# EAGLE design ATESLEME (EAGLE 9.6.2)
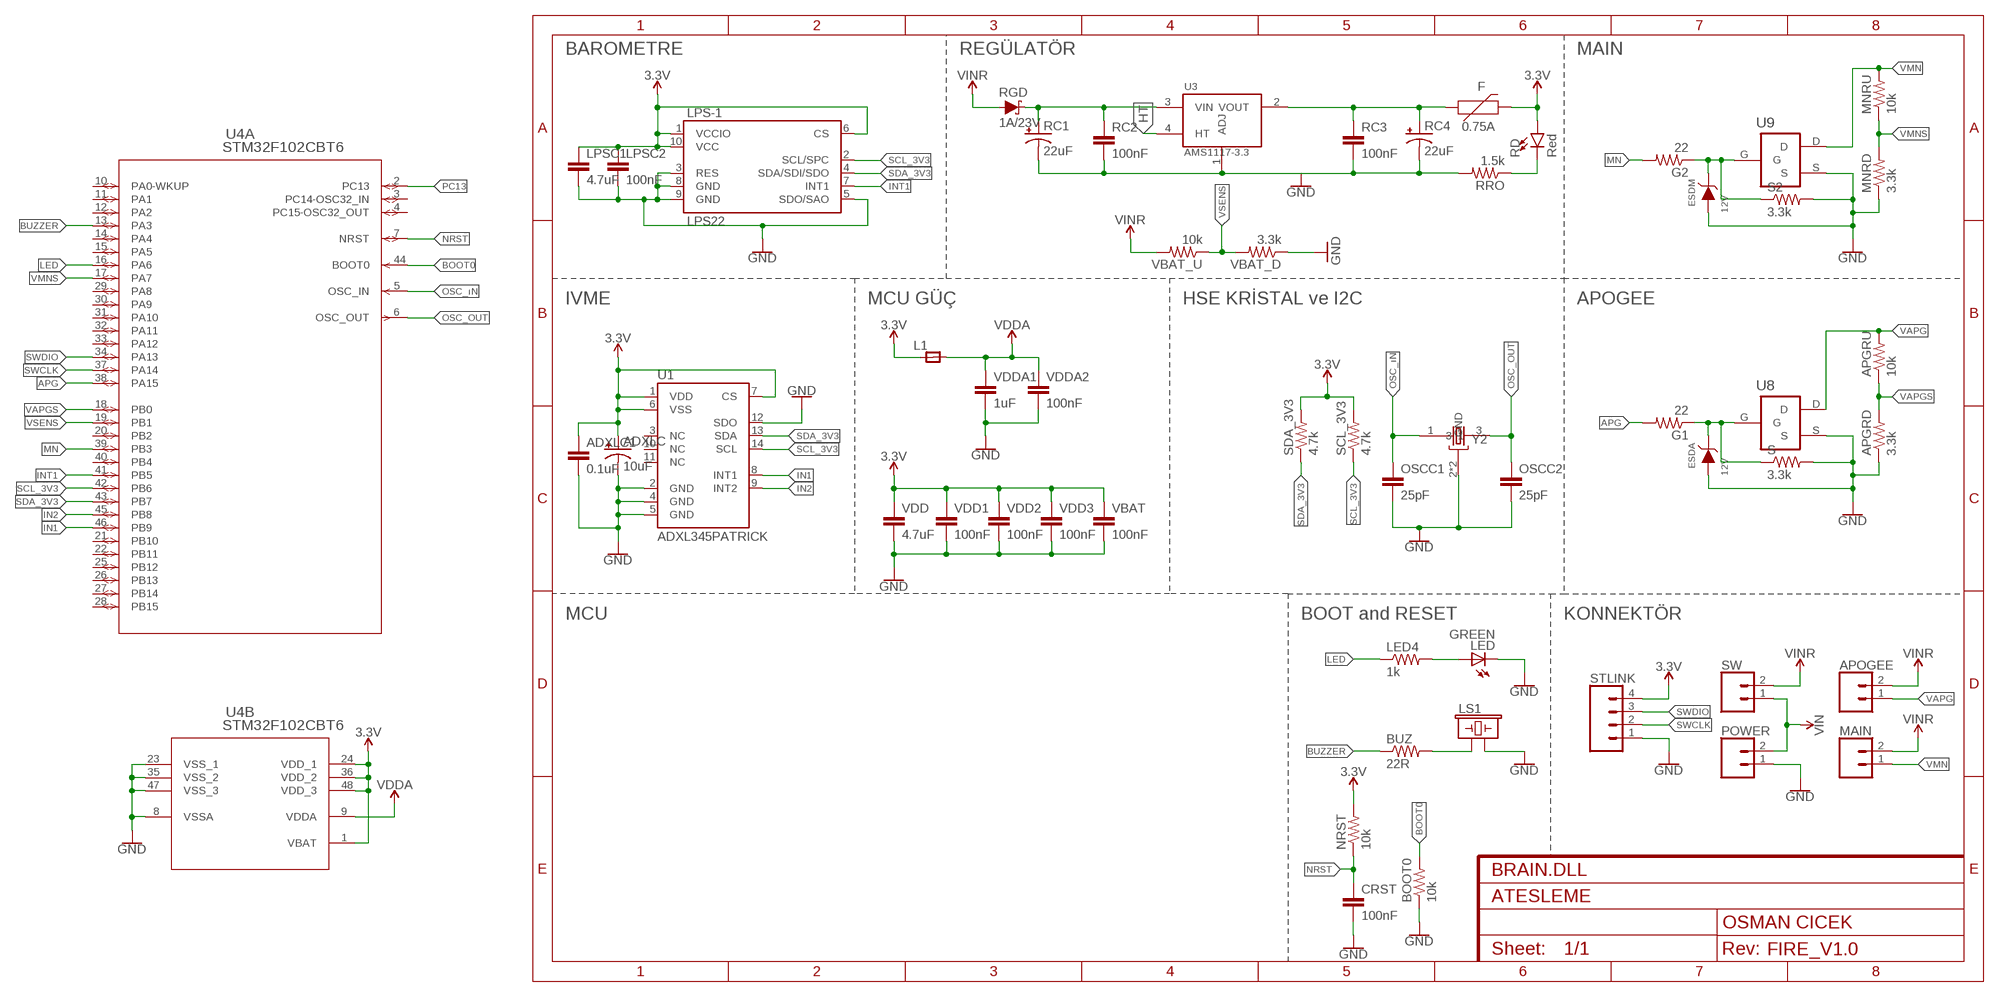
[diagram p0: schematic, sheet 1]
FRAME1 (FRAME-A4L): ATESLEME: PART1; CNAME: BRAIN.DLL; CREVISION: FIRE_V1.0; DESIGNER: OSMAN CICEK

## Parts
ADXLC  10uF  10UF-POLAR-EIA3216-16V-10%(TANT)  [EIA3216]
ADXLC1  0.1uF  0.1UF-0603-25V-(+80/-20%)  [0603]
APGRD  3.3k  2.0KOHM1/10W5%(0603)  [0603-RES]
APGRU  10k  2.0KOHM1/10W5%(0603)  [0603-RES]
APOGEE  CONN_023.5MM-NO_SILK  [SCREWTERMINAL-3.5MM-2-NS]
BOOT0  10k  2.0KOHM1/10W5%(0603)  [0603-RES]
BUZ  22R  2.0KOHM1/10W5%(0603)  [0603-RES]
CRST  100nF  0.1UF-0603-25V-(+80/-20%)  [0603]
ESDA  12V  WE-TVSP_DO-214AC_400W_UNI_824500102  [WE-TVSP_DO-214AC_UNIDIRECTIONAL]
ESDM  12V  WE-TVSP_DO-214AC_400W_UNI_824500102  [WE-TVSP_DO-214AC_UNIDIRECTIONAL]
F  0.75A  PPTC_THREE-QUARTER-AMP  [1206]
G1  22  2.0KOHM1/10W5%(0603)  [0603-RES]
G2  22  2.0KOHM1/10W5%(0603)  [0603-RES]
L1  RC-MASTER-SMD_FB_0805MP  [RC-MASTER-SMD_L0805MP]
LED  GREEN  LED-RED0603  [LED-0603]
LED4  1k  2.0KOHM1/10W5%(0603)  [0603-RES]
LPS-1  LPS22  LPS2XH-22  [LPS22H]
LPSC1  4.7uF  0.1UF-0603-25V-(+80/-20%)  [0603]
LPSC2  100nF  0.1UF-0603-25V-(+80/-20%)  [0603]
LS1  BUZZER-PTH  [BUZZER-12MM]
MAIN  CONN_023.5MM-NO_SILK  [SCREWTERMINAL-3.5MM-2-NS]
MNRD  3.3k  2.0KOHM1/10W5%(0603)  [0603-RES]
MNRU  10k  2.0KOHM1/10W5%(0603)  [0603-RES]
NRST  10k  2.0KOHM1/10W5%(0603)  [0603-RES]
OSCC1  25pF  0.1UF-0603-25V-(+80/-20%)  [0603]
OSCC2  25pF  0.1UF-0603-25V-(+80/-20%)  [0603]
POWER  CONN_023.5MM-NO_SILK  [SCREWTERMINAL-3.5MM-2-NS]
RC1  22uF  10UF-POLAR-EIA3528-20V-10%(TANT)  [EIA3528]
RC2  100nF  0.1UF-0603-25V-(+80/-20%)  [0603]
RC3  100nF  0.1UF-0603-25V-(+80/-20%)  [0603]
RC4  22uF  10UF-POLAR-EIA3528-20V-10%(TANT)  [EIA3528]
RD  Red  LED-RED0603-SMART  [LED-0603]
RGD  1A/23V  DIODE-SCHOTTKY-BAT20J  [SOD-323]
RRO  1.5k  2.0KOHM1/10W5%(0603)  [0603-RES]
S  3.3k  2.0KOHM1/10W5%(0603)  [0603-RES]
S2  3.3k  2.0KOHM1/10W5%(0603)  [0603-RES]
SCL_3V3  4.7k  2.0KOHM1/10W5%(0603)  [0603-RES]
SDA_3V3  4.7k  2.0KOHM1/10W5%(0603)  [0603-RES]
STLINK  CONN_04  [1X04]
SW  CONN_023.5MM-NO_SILK  [SCREWTERMINAL-3.5MM-2-NS]
U1  ADXL345PATRICK  [LGA14_1:1_PATRICK]
U3  AMS1117-3.3  [SOT229P700X180-4N]
U4  STM32F102CBT6  [LQFP48-7X7MM]
U8  IRLML6344TRPBF  [SOT95P240X112-3N]
U9  IRLML6344TRPBF  [SOT95P240X112-3N]
VBAT  100nF  0.1UF-0603-25V-(+80/-20%)  [0603]
VBAT_D  3.3k  2.0KOHM1/10W5%(0603)  [0603-RES]
VBAT_U  10k  2.0KOHM1/10W5%(0603)  [0603-RES]
VDD  4.7uF  0.1UF-0603-25V-(+80/-20%)  [0603]
VDD1  100nF  0.1UF-0603-25V-(+80/-20%)  [0603]
VDD2  100nF  0.1UF-0603-25V-(+80/-20%)  [0603]
VDD3  100nF  0.1UF-0603-25V-(+80/-20%)  [0603]
VDDA1  1uF  0.1UF-0603-25V-(+80/-20%)  [0603]
VDDA2  100nF  0.1UF-0603-25V-(+80/-20%)  [0603]
Y2  ABM2B-8.000MHZ-10-1-U-T  ABM3B-26.000MHZ-10-1-U-T  [OSCCC500X320X110-4N]

## Nets
3.3V: ADXLC1.1 ADXLC.+ F.2 L1.1 LPS-1.1(VCCIO) LPS-1.6(CS) LPS-1.10(VCC) LPSC1.1 LPSC2.1 NRST.2 RD.A SCL_3V3.2 SDA_3V3.2 STLINK.4 U1.1(VDD) U1.6(VSS) U1.7(CS) U4.1(B:VBAT) U4.24(B:VDD_1) U4.36(B:VDD_2) U4.48(B:VDD_3) VBAT.1 VDD1.1 VDD2.1 VDD3.1 VDD.1
APG: G1.2 U4.38(A:PA15)
BOOT0: BOOT0.2 U4.44(A:BOOT0)
BUZZER: BUZ.1 U4.13(A:PA3)
GND: ADXLC1.2 ADXLC.- APGRD.1 BOOT0.1 CRST.2 ESDA.2(A) ESDM.2(A) LED.C LPS-1.3(RES) LPS-1.5(SDO/SAO) LPS-1.8(GND) LPS-1.9(GND) LPSC1.2 LPSC2.2 LS1.- MNRD.1 OSCC1.2 OSCC2.2 POWER.1 RC1.C(-) RC2.2 RC3.2 RC4.C(-) RRO.2 S2.2 S.2 STLINK.1 U1.2(GND) U1.4(GND) U1.5(GND) U1.12(SDO) U3.1(ADJ) U4.8(B:VSSA) U4.23(B:VSS_1) U4.35(B:VSS_2) U4.47(B:VSS_3) U8.S U9.S VBAT.2 VBAT_D.1 VDD1.2 VDD2.2 VDD3.2 VDD.2 VDDA1.2 VDDA2.2 Y2.2(GND) Y2.4(GND)
HT: U3.4(HT)
IN1: U1.8(INT1) U4.46(A:PB9)
IN2: U1.9(INT2) U4.45(A:PB8)
INT1: LPS-1.7(INT1) U4.41(A:PB5)
LED: LED4.1 U4.16(A:PA6)
MN: G2.2 U4.39(A:PB3)
N$1: F.1 RC3.1 RC4.A(+) U3.2(VOUT)
N$2: RD.C RRO.1
N$8: ESDM.1(C) G2.1 S2.1 U9.G
N$10: LED4.2 LED.A
N$13: BUZ.2 LS1.+
N$14: ESDA.1(C) G1.1 S.1 U8.G
NRST: CRST.1 NRST.1 U4.7(A:NRST)
OSC_OUT: OSCC2.1 U4.6(A:OSC_OUT) Y2.3
OSC_ıN: OSCC1.1 U4.5(A:OSC_IN) Y2.1
PC13: U4.2(A:PC13)
SCL_3V3: LPS-1.2(SCL/SPC) SCL_3V3.1 U1.14(SCL) U4.42(A:PB6)
SDA_3V3: LPS-1.4(SDA/SDI/SDO) SDA_3V3.1 U1.13(SDA) U4.43(A:PB7)
SWCLK: STLINK.2 U4.37(A:PA14)
SWDIO: STLINK.3 U4.34(A:PA13)
VAPG: APGRU.2 APOGEE.1 U8.D
VAPGS: APGRD.2 APGRU.1 U4.18(A:PB0)
VCC: POWER.2 SW.1 ; supply symbol labelled VIN
VDDA: L1.2 U4.9(B:VDDA) VDDA1.1 VDDA2.1
VIN: APOGEE.2 MAIN.2 RGD.A SW.2 VBAT_U.2 ; supply symbol labelled VINR
VMN: MAIN.1 MNRU.2 U9.D
VMNS: MNRD.2 MNRU.1 U4.17(A:PA7)
VNR: RC1.A(+) RC2.1 RGD.C U3.3(VIN)
VSENS: U4.19(A:PB1) VBAT_D.2 VBAT_U.1
Unconnected: U1.3(NC) U1.10(NC) U1.11(NC) U4.3(A:PC14-OSC32_IN) U4.4(A:PC15-OSC32_OUT) U4.10(A:PA0-WKUP) U4.11(A:PA1) U4.12(A:PA2) U4.14(A:PA4) U4.15(A:PA5) U4.20(A:PB2) U4.21(A:PB10) U4.22(A:PB11) U4.25(A:PB12) U4.26(A:PB13) U4.27(A:PB14) U4.28(A:PB15) U4.29(A:PA8) U4.30(A:PA9) U4.31(A:PA10) U4.32(A:PA11) U4.33(A:PA12) U4.40(A:PB4)

## Notes on the sheet
- BAROMETRE | REGÜLATÖR | MAIN
- IVME | MCU GÜÇ | HSE KRİSTAL ve I2C | APOGEE
- MCU | BOOT and RESET | KONNEKTÖR

## Library data of the parts
ADXLC = SparkFun-Capacitors:10UF-POLAR: 10.0µF polarized capacitors A capacitor is a passive two-terminal electrical component used to store electrical energy temporarily in an electric field.; PROD_ID: CAP-00811
ADXLC1 = SparkFun-Capacitors:0.1UF: 0.1µF ceramic capacitors A capacitor is a passive two-terminal electrical component used to store electrical energy temporarily in an electric field.; PROD_ID: CAP-00810
APGRD APGRU BOOT0 BUZ G1 G2 LED4 MNRD MNRU NRST RRO S S2 SCL_3V3 SDA_3V3 VBAT_D VBAT_U = SparkFun-Resistors:2.0KOHM1/10W5%(0603): RES-08296; PROD_ID: RES-08296; VALUE: 2.0k
APOGEE MAIN POWER SW = SparkFun-Connectors:CONN_02: Multi connection point. Often used as Generic Header-pin footprint for 0.1 inch spaced/style header connections On any of the 0.1 inch spaced packages, you can populate with these: Break Away Headers - Straight <https://www.sparkfun.com/products/116> (PRT-00116) Break Away Male Headers - Right Angle <https://www.sparkfun.com/products/553> (PRT-00553) Female Headers <https://www.sparkfun.com/products/115> (PRT-00115) Break Away Headers - Machine Pin <https://www.sparkfun.com/products/117> (PRT-00117) Break Away Female Headers - Swiss Machine Pin <https://www.sparkfun.com/products/743> (PRT-00743) For SCREWTERMINALS and SPRING TERMINALS visit here: Screw Terimnals on SparkFun.com <https://www.sparkfun.com/search/results?term=Screw+Terminals> (5mm/3.5mm/2.54mm spacing) This device is also useful as a general connection point to wire up your design to another part of your project. Our various solder wires solder well into these plated through hole pads. Hook-Up Wire - Assortment (Stranded, 22 AWG) <https://www.sparkfun.com/products/11375> (PRT-11375) Hook-Up Wire - Assortment (Solid Core, 22 AWG) <https://www.sparkfun.com/products/11367> (PRT-11367) View the entire wire category on our website here <https://www.sparkfun.com/categories/141> Special notes: Molex polarized connector foot print use with: PRT-08233 with associated crimp pins and housings. 2.54_SCREWTERM for use with PRT-10571. 3.5mm Screw Terminal footprints for PRT-08084 5mm Screw Terminal footprints for use with PRT-08432; PROD_ID: CONN-08399
CRST LPSC1 LPSC2 OSCC1 OSCC2 RC2 RC3 VBAT VDD VDD1-VDD3 VDDA1 VDDA2 = SparkFun-Capacitors:0.1UF: 0.1µF ceramic capacitors A capacitor is a passive two-terminal electrical component used to store electrical energy temporarily in an electric field.; PROD_ID: CAP-00810; VALUE: 0.1uF
ESDA ESDM = Wurth_EMC Components_WE-TVSP:WE-TVSP_DO-214AC_400W_UNI: WE-TVSP Power TVS Diode Characteristics Low Profile Package Glass passivated Juction Excellent clamping capability Fast response time MSL Level 1, per J-STD-020 Classification of the plastic case: UL 94 V-0 Safety certification UL 497B, E478010 Identical design: - DO-214AC = SMAJ - DO-214AA = SMBJ - DO-214AB = SMCJ/SMDJ Applications Ideal to protect the I/O Interfaces, Bus Voltage and other circuits of sensetive electronic equipment against voltage transiensts <https://www.we-online.com/catalog/media/o55793v209%20WE-TVSP_600W-3000W_D0214AA_4C.jpg> Details see: https://www.we-online.com/catalog/en/WE-TVSP/ Updated by Ella Wu 2020-07-20 2020 (C) Würth Elektronik; DATASHEET-URL: https://www.we-online.com/catalog/datasheet/824500102.pdf; IPEAK: 2.5A; MOUNT: SMT; PART-NUMBER: 824500102; PDISS: 400W; VALUE: 100V; VBR: 117V; VCLAMP: 162V
F = SparkFun-Fuses:PPTC: Resettable Fuse PPTC Resettable Fuse. Really a sort of resistor with a polymeric positive temperature coefficient whose resistance increases dramatically with an increase in temperature. When heated by the power passing through the resistance rises causing the current to be limited, protecting the circuit. This is achieved by the transition of the polymer from a crystalline to an amorphous state where the conductive carbon separates breaking the conductive pathways found in the cool crystalline structure. When a PPTC cools back down it resumes conducting letting the circuit turn back on. SparkFun Products: SparkFun RedBoard - Programmed with Arduino <https://www.sparkfun.com/products/12757> Pro Micro - 5V/16MHz <https://www.sparkfun.com/products/12640> Arduino Pro 328 - 5V/16MHz <https://www.sparkfun.com/products/10915> MP3 Trigger <https://www.sparkfun.com/products/13720>; PROD_ID: RES-11150; VALUE: 6V/0.75A
L1 = 52101-101-REV-A_v16:RC-MASTER-SMD_FB_: FERRITE BEAD
LED = SparkFun-LED:LED-RED: Assorted Red LEDs LilyPad 1206- DIO-09912 1206- DIO-00809 0603- DIO-00819; PROD_ID: DIO-00819; VALUE: RED
LPS-1 = Arduino-Sensors:LPS2XH; CODE-ARDUINO: A5390; DATASHEET: https://www.st.com/content/ccc/resource/technical/document/datasheet/bf/c1/4f/23/61/17/44/8a/DM00140895.pdf/files/DM00140895.pdf/jcr:content/translations/en.DM00140895.pdf; DISTRIBUTOR-LINK: https://www.digikey.com/product-detail/en/stmicroelectronics/LPS22HBTR/497-16265-1-ND/5799917; DISTRIBUTOR-PN: 497-16265-1-ND; MANUFACTURER: ST; MANUFACTURER-PN: LPS22HBTR
LS1 = SparkFun-Electromechanical:BUZZER: Buzzer Small round buzzers that operate around the audible 2kHz range. You can use these as speakers to create simple music or user interfaces. Variant Overview: PTH - Mini Speaker - PC Mount 12mm 2.048kHz <https://www.sparkfun.com/products/7950> PTH_KIT - Mini Speaker - PC Mount 12mm 2.048kHz <https://www.sparkfun.com/products/7950> KIT simplifies soldering by adding stop mask to one side of the pads. PTH_NO_SILK - Mini Speaker - PC Mount 12mm 2.048kHz <https://www.sparkfun.com/products/7950> No silkscreen indicator of buzzer outline. PTH_KIT_NO_SILK - Mini Speaker - PC Mount 12mm 2.048kHz <https://www.sparkfun.com/products/7950> KIT package w/o silkscreen SMD - Buzzer Audio Magnetic (CCV-084B16) SMD buzzer used on, e.g. the LilyPad Buzzer <https://www.sparkfun.com/products/8463> and RFID USB Reader <https://www.sparkfun.com/products/9963>. SMD_KIT - Buzzer Audio Magnetic (CCV-084B16) SMD Buzzer with elongated pins to make soldering easier. Used on the SparkFun Simon Says - Surface Mount Soldering Kit <https://www.sparkfun.com/products/10935>.; PROD_ID: COMP-08253; SF_SKU: COM-07950
RC1 RC4 = SparkFun-Capacitors:10UF-POLAR: 10.0µF polarized capacitors A capacitor is a passive two-terminal electrical component used to store electrical energy temporarily in an electric field.; PROD_ID: CAP-08063; VALUE: 10uF
RD = SparkFun-LED:LED-RED: Red SMD LED Used in manufacturing of most products at SparkFun Packages: 0603 - SMD 0603 package [Product Link] <http://docs.avagotech.com/docs/AV02-0551EN> 0603 SMART - SMD 0603 SMART package ( more efficient and expensive)[Product Link] <http://www.osram-os.com/Graphics/XPic2/00077099_0.pdf> 1206 - SMD1206 package [Product Link] <https://www.sparkfun.com/datasheets/DevTools/LilyPad/Q150OVS4.pdff> SparkFun Products: Pro Mini 328 -5V <https://www.sparkfun.com/products/821> RedBoard <https://www.sparkfun.com/products/12757> IOIO-OTG <https://www.sparkfun.com/products/13613>; PROD_ID: DIO-11154
RGD = SparkFun-DiscreteSemi:DIODE-SCHOTTKY: Schottky diode A Schottky diode is a semiconductor diode which has a low forward voltage drop and a very fast switching action.; PROD_ID: DIO-11623; VALUE: 1A/23V/620mV
STLINK = SparkFun-Connectors:CONN_04: Multi connection point. Often used as Generic Header-pin footprint for 0.1 inch spaced/style header connections On any of the 0.1 inch spaced packages, you can populate with these: Break Away Headers - Straight <https://www.sparkfun.com/products/116> (PRT-00116) Break Away Male Headers - Right Angle <https://www.sparkfun.com/products/553> (PRT-00553) Female Headers <https://www.sparkfun.com/products/115> (PRT-00115) Break Away Headers - Machine Pin <https://www.sparkfun.com/products/117> (PRT-00117) Break Away Female Headers - Swiss Machine Pin <https://www.sparkfun.com/products/743> (PRT-00743) For SCREWTERMINALS and SPRING TERMINALS visit here: Screw Terimnals on SparkFun.com <https://www.sparkfun.com/search/results?term=Screw+Terminals> (5mm/3.5mm/2.54mm spacing) This device is also useful as a general connection point to wire up your design to another part of your project. Our various solder wires solder well into these plated through hole pads. Hook-Up Wire - Assortment (Stranded, 22 AWG) <https://www.sparkfun.com/products/11375> (PRT-11375) Hook-Up Wire - Assortment (Solid Core, 22 AWG) <https://www.sparkfun.com/products/11367> (PRT-11367) View the entire wire category on our website here <https://www.sparkfun.com/categories/141> Special notes: Molex polarized connector foot print use with SKU : PRT-08231 with associated crimp pins and housings. 1MM SMD Version SKU: PRT-10208; PROD_ID: CONN-09696
U1 = Testing:ADXL345
U3 = AMS1117-3.3:AMS1117-3.3: Sot223/Pkg 1-Amp 3.3-Volt Low Drop Out Voltage Regulatator; AVAILABILITY: Unavailable; DESCRIPTION: Sot223/Pkg 1-Amp 3.3-Volt Low Drop Out Voltage Regulatator; MF: Advanced Monolithic Systems; MP: AMS1117-3.3; PACKAGE: SOT-89 ams; PRICE: None
U4 = STM32F102CBT6:STM32F102CBT6; BUILT_BY: EMA_UL_Team; COPYRIGHT: Copyright (C) 2018 Accelerated Designs. All rights reserved; MANUFACTURER_PART_NUMBER: STM32F102CBT6; SOURCELIBRARY: Updates_to_database_2020-10-19; VENDOR: STMicroelectronics
U8 U9 = IRLML6344TRPBF:IRLML6344TRPBF: Power MOSFET Check prices <https://pricing.snapeda.com/parts/IRLML6344TRPBF/Infineon%20Technologies/view-part?ref=eda>; AVAILABILITY: Good; DESCRIPTION: N-Channel 30V 5A (Ta) 1.3W (Ta) Surface Mount Micro3™/SOT-23; MF: Infineon Technologies; MP: IRLML6344TRPBF; PACKAGE: SOT-23 Multicomp; PRICE: None; PURCHASE-URL: https://pricing.snapeda.com/search/part/IRLML6344TRPBF/?ref=eda
Y2 = ABM3B-26.000MHZ-10-1-U-T:ABM3B-26.000MHZ-10-1-U-T: Ceramic SMD Crystal Check prices <https://pricing.snapeda.com/parts/ABM3B-26.000MHZ-10-1-U-T/Abracon/view-part?ref=eda>; AVAILABILITY: Good; DESCRIPTION: 26MHz ±10ppm Crystal 10pF 50 Ohms 4-SMD, No Lead; MF: Abracon; MP: ABM3B-26.000MHZ-10-1-U-T; PACKAGE: SMD-4 Abracon LLC; PRICE: None; PURCHASE-URL: https://pricing.snapeda.com/search/part/ABM3B-26.000MHZ-10-1-U-T/?ref=eda

## Board
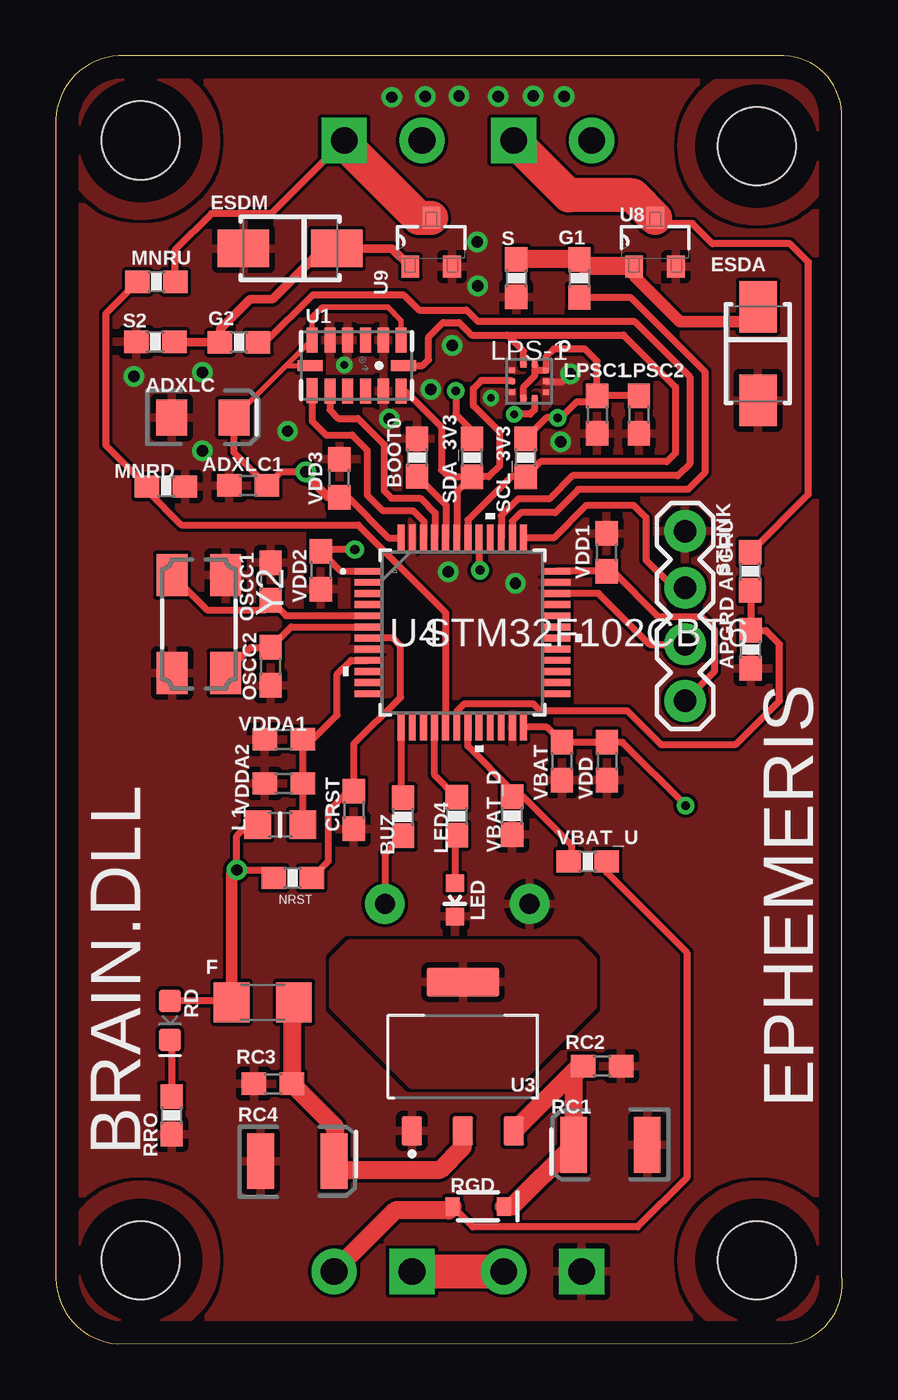
[diagram p1: board, top side]
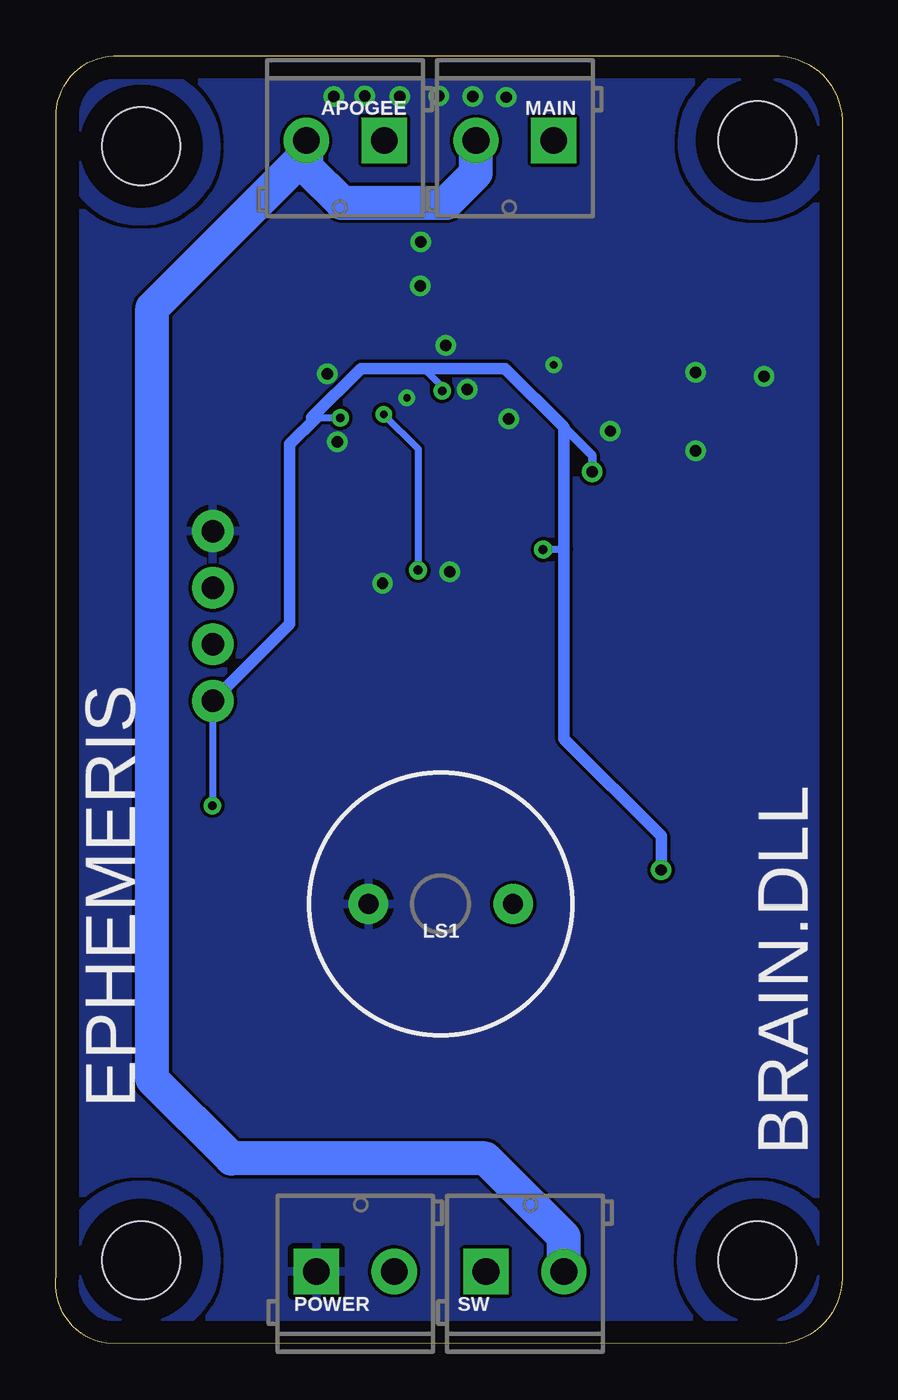
[diagram p2: board, bottom side, seen from below]

Size 35.34 x 57.86 mm. Coordinates in mm from the lower left corner, seen from the top.
Outline: 0.01,54.99 0.01,3.23 arc90 2.78,0 33.05,0.03 arc90 35.31,3.07 35.31,55.07 arc90 32.72,57.86 3.11,57.86 arc90 0.01,54.99
Copper layers (1*16): Top 0.035mm / dielectric 1.5mm / Bottom 0.035mm
Design rules "default": minimum track width 6mil, minimum drill 0.35mm, track to track 6mil, track to pad 6mil, pad to pad 6mil, via to via 6mil, smd to smd 6mil, copper to edge 40mil, drill to drill 6mil, minimum pad ring 10mil, minimum via ring 8mil, stop-mask expansion 4mil, vias tented up to drill 0mil, thermal gap 10mil
Holes 3.5 mm at 31.5,3.75 3.82,3.75 3.82,54.05 31.5,53.8

### Footprints (pad centres in the part's own frame; a part is rotated, then mirrored left to right if it is on the bottom)
EIA3216 = smd 1.4 x 1.6: + 1.4,0; - -1.4,0
0603 = smd 1.1 x 1: 1 -0.85,0; 2 0.85,0
0603-RES = smd 1.1 x 1: 1 -0.85,0; 2 0.85,0
SCREWTERMINAL-3.5MM-2-NS = drill 1.2 pad 2.032 square: 1 0,0 | drill 1.2 pad 2.032: 2 3.5,0
WE-TVSP_DO-214AC_UNIDIRECTIONAL = smd 2.3 x 1.7: 1 -2.1,0; 2 2.1,0
1206 = smd 1.6 x 1.8: 1 -1.4,0; 2 1.4,0
RC-MASTER-SMD_L0805MP = smd 1.2 x 1.3: 1 -1.016,0; 2 1.016,0
LED-0603 = smd 0.8 x 0.8: A 0,-0.75; C 0,0.75
LPS22H = smd 0.25 x 0.275: 1 -0.25,-0.762; 2 0.25,-0.762; 6 0.25,0.762; 7 -0.25,0.762 | smd 0.275 x 0.25: 3 0.762,-0.5; 4 0.762,0; 5 0.762,0.5; 8 -0.762,0.5; 9 -0.762,0; 10 -0.762,-0.5
BUZZER-12MM = drill 0.9 pad 1.778: + 3.25,0; - -3.25,0
EIA3528 = smd 1.2 x 2.5: A 1.65,0; C -1.65,0
LED-0603' = smd 1 x 1: A -0.877,0; C 0.877,0
SOD-323 = smd 0.63 x 0.83: A 1.15,0; C -1.15,0
1X04 = drill 1.016 pad 1.88: 1 0,0; 2 2.54,0; 3 5.08,0; 4 7.62,0
LGA14_1:1_PATRICK = smd 0.5 x 1.124: 1 2,1.138; 2 1.2,1.138; 3 0.4,1.138; 4 -0.4,1.138; 5 -1.2,1.138; 6 -2,1.138; 8 -2,-1.13; 9 -1.2,-1.138; 10 -0.4,-1.138; 11 0.4,-1.138; 12 1.2,-1.138; 13 2,-1.138 | smd 1.124 x 0.5: 7 -2.1,0; 14 2.1,0
SOT229P700X180-4N = smd 0.93 x 1.31: 1 -2.29,-3.345; 2 0,-3.345; 3 2.29,-3.345 | smd 3.24 x 1.31: 4 0,3.345
LQFP48-7X7MM = smd 1.194 x 0.305: 1 -4.25,2.75; 2 -4.25,2.25; 3 -4.25,1.75; 4 -4.25,1.25; 5 -4.25,0.75; 6 -4.25,0.25; 7 -4.25,-0.25; 8 -4.25,-0.75; 9 -4.25,-1.25; 10 -4.25,-1.75; 11 -4.25,-2.25; 12 -4.25,-2.75; 25 4.25,-2.75; 26 4.25,-2.25; 27 4.25,-1.75; 28 4.25,-1.25; 29 4.25,-0.75; 30 4.25,-0.25; 31 4.25,0.25; 32 4.25,0.75; 33 4.25,1.25; 34 4.25,1.75; 35 4.25,2.25; 36 4.25,2.75 | smd 0.305 x 1.194: 13 -2.75,-4.25; 14 -2.25,-4.25; 15 -1.75,-4.25; 16 -1.25,-4.25; 17 -0.75,-4.25; 18 -0.25,-4.25; 19 0.25,-4.25; 20 0.75,-4.25; 21 1.25,-4.25; 22 1.75,-4.25; 23 2.25,-4.25; 24 2.75,-4.25; 37 2.75,4.25; 38 2.25,4.25; 39 1.75,4.25; 40 1.25,4.25; 41 0.75,4.25; 42 0.25,4.25; 43 -0.25,4.25; 44 -0.75,4.25; 45 -1.25,4.25; 46 -1.75,4.25; 47 -2.25,4.25; 48 -2.75,4.25
SOT95P240X112-3N = smd 0.972 x 0.802: D 1.092,0; G -1.092,0.94; S -1.092,-0.94
OSCCC500X320X110-4N = smd 1.9 x 1.4: 1 -2.2,-1.2; 2 2.2,-1.2; 3 2.2,1.2; 4 -2.2,1.2

### Placement (x,y rotation side)
ADXLC  6.61,41.61 0 top
ADXLC1  8.64,38.56 180 top
APGRD  31.22,31.19 90 top
APGRU  31.2,34.7 90 top
APOGEE  20.58,54.05 180 bottom
BOOT0  16.24,39.81 270 top
BUZ  15.6,23.67 270 top
CRST  13.39,23.98 270 top
ESDA  31.56,44.48 270 top
ESDM  10.54,49.2 180 top
F  9.3,15.34 180 top
G1  23.53,47.86 270 top
G2  8.24,44.98 0 top
L1  10.09,23.32 0 top
LED  17.94,19.94 180 top
LED4  18.02,23.7 270 top
LPS-1  21.27,43.23 180 top
LPSC1  24.32,41.74 270 top
LPSC2  26.2,41.74 270 top
LS1  18.04,19.76 0 bottom
MAIN  12.96,54.05 180 bottom
MNRD  4.96,38.51 180 top
MNRU  4.53,47.7 0 top
NRST  10.65,20.93 180 top
OSCC1  9.66,34.24 90 top
OSCC2  9.66,30.43 270 top
POWER  23.63,3.25 0 bottom
RC1  24.93,8.94 180 top
RC2  24.54,12.47 0 top
RC3  9.76,11.68 180 top
RC4  10.85,8.2 0 top
RD  Red  [LED-0603']  5.14,14.53 270 top
RGD  18.98,6.17 180 top
RRO  5.22,10.26 270 top
S  20.7,47.87 270 top
S2  4.48,45.01 180 top
SCL_3V3  21.12,39.8 90 top
SDA_3V3  18.7,39.8 90 top
STLINK  28.28,36.5 270 top
SW  16.01,3.25 0 bottom
U1  13.52,43.94 0 top
U3  18.3,12.9 0 top
U4  18.27,31.95 0 top
U8  26.93,49.48 90 top
U9  16.87,49.48 90 top
VBAT  22.75,26.17 270 top
VBAT_D  20.51,23.72 90 top
VBAT_U  23.91,21.67 0 top
VDD  24.77,26.17 270 top
VDD1  24.75,35.55 90 top
VDD2  11.91,34.75 270 top
VDD3  12.75,38.88 90 top
VDDA1  10.24,27.15 180 top
VDDA2  10.24,25.17 180 top
Y2  6.43,32.33 270 top

### Tracks (layer width: path | path; a pad name or v marks a point on that pad's centre or on a via)
3.3V  (via drill 0.38, 0.41, 0.51)
  Top 0.152: LPS-1.10 | LPS-1.1 21.53,43.98
  Top 0.229: U1.7 10.35,43.94 ADXLC.+ 11.49,45.08 U1.6
  Top 0.254: U1.1 15.52,45.97 14.93,46.56 11.96,46.56 11.52,46.12 U1.6
  Top 0.305: F.2 7.84,15.41 RD.A | VDD3.1 13.13,38.03 14.96,36.2 U4.48 | 21.53,43.73 LPS-1.10 | v17.98,42.81 17.98,41.75 18.7,41.02 SDA_3V3.2 | SCL_3V3.2 22.06,41.6 v22.55,41.6 22.62,41.52 23.39,42.29 24.02,42.29 LPSC1.1 | LPSC2.1 LPSC1.1 | STLINK.4 29.6,30.2 29.6,32.08 29,32.68 27.06,32.68 25.04,34.7 VDD1.1 U4.36 | v28.3,24.18 25.46,27.02 VDD.1 22.76,27.02 VBAT.1 22.07,27.7 U4.24 | v11.24,39.17 10.1,39.17 ADXLC1.1 8.01,40.04 ADXLC.+ | LPS-1.10 22.03,44.34 22.38,44.68 23.78,44.68 24.32,44.14 LPSC1.1 | LPS-1.6 21.02,42.98 21.53,43.49 21.53,43.73 | 21.53,43.98 21.53,43.73 | L1.1 8.64,23.32 8.14,22.81 v8.14,21.29 9.45,21.29 NRST.2 | v13.44,35.68 11.99,35.68 VDD2.1 12.81,34.7 U4.1
  Top 0.381: VDD3.1 12.24,38.03 11.24,39.03 v11.24,39.17
  Top 0.508: v8.14,21.29 7.9,21.05 F.2
  Bottom 0.305: 23.83,41.61 23.63,41.61 22.76,41.61 22.75,41.6 v22.55,41.6 | v28.3,24.18 28.28,24.21 STLINK.4 | 12.51,35.68 v13.44,35.68 | v17.98,42.81 17.98,43 18.79,43.81 19.85,43.81
  Bottom 0.381: v11.24,39.17 11.24,39.9 12.51,41.17
  Bottom 0.508: v8.14,21.29 8.14,22.81 12.51,27.18 12.51,35.68 12.51,41.17 15.15,43.81 19.85,43.81 21.62,43.81 23.83,41.61 | 23.63,41.61 24.82,40.41 24.82,32.33 STLINK.4
APG
  Top 0.305: G1.2 25.82,47.01 29.17,43.66 29.17,39.14 28.4,38.37 23.48,38.37 22.45,37.34 20.91,37.34 20.52,36.95 U4.38
BOOT0
  Top 0.305: BOOT0.2 16.26,38.96 17.55,37.67 17.55,36.23 U4.44
BUZZER
  Top 0.305: U4.13 15.52,24.61 BUZ.1
D
  pour Top: 0.31,54.05 arc-90 3.82,57.56 arc-90 7.32,54.03 arc-90 3.84,50.55 arc-90
  pour Top: 28,53.8 arc-90 31.53,57.3 arc-90 35.01,53.77 arc-90 31.5,50.29 arc-90
  pour Top: 28,3.76 arc-90 31.53,7.26 arc-90 35.01,3.78 arc-90 31.48,0.25 arc-90
  pour Top: 0.31,3.76 arc-90 3.82,7.26 arc-90 7.32,3.76 arc-90 3.82,0.25 arc-90
  pour Bottom: 35.01,3.78 arc90 31.53,7.26 31.5,7.26 arc90 28,3.76 28,3.71 arc90 31.45,0.25 31.48,0.25 arc90
  pour Bottom: 7.36,3.75 arc90 3.82,7.26 arc90 0.34,3.73 arc90 3.87,0.26 arc90
  pour Bottom: 7.32,54.03 arc90 3.79,57.56 arc90 0.31,54.05 arc90 3.87,50.55 arc90
  pour Bottom: 35.01,53.82 arc90 31.53,57.3 arc90 28,53.77 arc90 31.56,50.29 arc90
GND  (via drill 0.33, 0.51)
  Top 0.305: LPS-1.9 22.79,43.23 v23.13,43.57
  other vias: 19.56,42.49 22.69,40.51 16.85,42.88 14.99,41.55 17.82,44.85 17.64,34.67 20.66,34.16 12.96,43.97 10.42,41 18.96,47.51 18.94,49.49 15.1,56 16.6,56.02 18.12,56.05 19.88,56.02 21.45,56.05 22.85,56.02 6.59,43.64 3.51,43.46 6.59,40.11
  pour Top (rank 2): -2.02,59.89 -2.02,-2.84 38.87,-2.84 38.87,59.89
  pour Bottom (rank 2): -3.29,61.42 -3.29,-4.62 40.39,-4.62 40.39,61.42
HT
  pour Top: 16.01,11.63 20.58,11.63 24.14,15.19 24.14,17.22 23.38,17.98 13.22,17.98 12.45,17.22 12.45,15.19
IN1
  Top 0.305: U1.8 11.52,41.45 12.15,40.82 13.32,40.82 14.01,40.13 14.01,38.11 14.71,37.41 16.08,37.41 16.54,36.94 16.54,36.23 U4.46
IN2
  Top 0.305: U1.9 12.32,41.94 12.69,41.57 13.58,41.57 14.75,40.39 14.75,38.32 15.09,37.99 16.38,37.99 17.05,37.32 17.05,36.23 U4.45
INT1  (via drill 0.35, 0.41)
  Top 0.152: LPS-1.7 | v20.6,41.75 20.61,41.76
  Top 0.305: LPS-1.7 21.52,41.96 21.32,41.76 20.61,41.76 | U4.41 19.02,34.78 v19.06,34.75
  Bottom 0.305: v20.6,41.75 19.06,40.21 v19.06,34.75
LED
  Top 0.305: U4.16 17.02,25.54 LED4.1
MN
  Top 0.305: G2.2 9.42,44.98 11.56,47.12 15.63,47.12 16.32,46.43 18.45,46.43 18.95,45.93 25.99,45.93 28.48,43.43 28.48,39.52 27.95,38.99 23.22,38.99 22.18,37.95 20.78,37.95 20.02,37.2 U4.39
N$1
  Top 0.813: F.1 10.61,15.25 RC3.1 12.54,9.75 12.54,8.24 RC4.A 12.89,7.82 17.28,7.82 18.3,8.84 U3.2
N$2
  Top 0.305: RD.C 5.22,13.58 RRO.1
N$8
  Top 0.381: S2.1 5.35,44.98 G2.1 7.39,45.57 8.74,46.92 9.74,46.92 12.02,49.2 ESDM.1 15.12,49.2 U9.G
N$10
  Top 0.229: LED4.2 17.94,22.77
  Top 0.305: 17.94,22.77 LED.A
N$13
  Top 0.305: BUZ.2 14.79,22.01 LS1.+
N$14
  Top 0.508: U8.G 25.99,47.96 28.04,45.91 30.89,45.91 ESDA.1
  Top 0.813: U8.G 25.99,48.4 23.84,48.4 G1.1 S.1
NRST
  Top 0.305: NRST.1 12.25,21.68 12.25,23.93 13.15,24.83 CRST.1 13.39,26.93 15.5,29.04 15.5,31.35 15.15,31.7 U4.7
OSC_OUT
  Top 0.305: Y2.3 8.78,31.28 OSCC2.1 10.58,32.2 U4.6
OSC_ıN
  Top 0.229: 9.76,33.29 OSCC1.1
  Top 0.305: Y2.1 6.8,32.97 9.43,32.97 9.76,33.29 10.35,32.7 U4.5
SCL_3V3
  Top 0.305: U1.14 16.49,43.94 16.75,44.21 16.75,45.22 17.41,45.87 18.12,45.87 18.68,45.31 20.3,45.31 | 20.3,45.31 25.52,45.31 27.85,42.98 27.85,40.02 27.46,39.63 21.79,39.63 SCL_3V3.1 20.47,38.95 18.52,37 U4.42 | LPS-1.2 21.02,44.59 20.3,45.31
SDA_3V3
  Top 0.305: SDA_3V3.1 19.45,38.95 19.95,39.45 19.95,40.95 18.76,42.14 18.76,42.92 19.12,43.27 20.46,43.27 LPS-1.4 | U1.13 15.6,42.73 15.78,42.73 17.33,41.17 17.33,39.27 17.65,38.95 SDA_3V3.1 | U4.43 18.02,38.27 SDA_3V3.1
SWCLK
  Top 0.305: STLINK.2 27.77,33.96 26.52,35.2 26.52,37.12 25.97,37.67 23.85,37.67 22.38,36.2 U4.37
SWDIO
  Top 0.305: STLINK.3 26.68,31.42 24.39,33.7 U4.34
VAPG
  Top 0.305: APGRU.2 33.82,38.16 33.82,48.59 32.99,49.42 29.51,49.42 28.61,50.32 27.19,50.32 U8.D
  Top 1.524: U8.D 25.92,51.59 23.05,51.59 APOGEE.1
VAPGS
  Top 0.229: APGRU.1 31.22,33.82
  Top 0.305: 31.22,33.82 APGRD.2 31.91,32.04 32.52,31.43 32.52,28.88 30.56,26.92 27.19,26.92 25.68,28.43 21.77,28.43 21.45,28.75 18.37,28.75 18.02,28.4 U4.18
VCC
  Top 1.524: SW.1 POWER.2
VDDA
  Top 0.229: 11.55,27.15 VDDA1.1 | L1.2 11.09,23.33
  Top 0.305: 11.55,27.15 12.64,28.24 12.64,30.08 13.27,30.7 U4.9 | VDDA1.1 VDDA2.1 11.09,23.33
VIN
  Top 0.305: VBAT_U.2 24.76,21.17 28.35,17.58 28.35,7.47 26.14,5.26 18.75,5.26 RGD.A
  Top 0.813: SW.2 15.25,5.99 17.65,5.99 RGD.A
  Bottom 0.813: APOGEE.2 24.08,53.44
  Bottom 1.524: 24.08,53.44 31,46.53 31,11.89 27.44,8.33 16.04,8.33 12.51,4.8 SW.2 | APOGEE.2 24.08,52.86 22.48,51.26 17.79,51.26 16.46,52.58 MAIN.2
VMN
  Top 0.305: MNRU.2 5.38,49.15 7,50.77 9.69,50.77 MAIN.1
  Top 1.524: U9.D 16.32,50.57 12.96,53.92 MAIN.1
VMNS
  Top 0.229: MNRD.2 4.11,38.31
  Top 0.305: MNRD.2 2.26,40.36 2.26,46.28 MNRU.1 | 4.11,38.31 5.65,36.78 13.59,36.78 17.52,32.85 17.52,27.72 U4.17
VNR
  Top 0.813: RGD.C 20.51,6.17 RC1.A 23.28,12.05 RC2.1 23.5,12.47 U3.3
VSENS
  Top 0.305: VBAT_U.1 23.17,21.78 23.17,22.41 21.01,24.57 VBAT_D.2 20.51,24.87 18.52,26.85 U4.19

### Text on the board
tPlace: BRAIN.DLL | EPHEMERIS
bPlace: BRAIN.DLL | EPHEMERIS